# EasyEDA schematic SCH_Keyboard_2024-07-21.json
TITLE: Keyboard; REV: 1.0; Date: 2024-06-02; Sheet: 1/1; Drawn By: cashimor; Company: Mosha
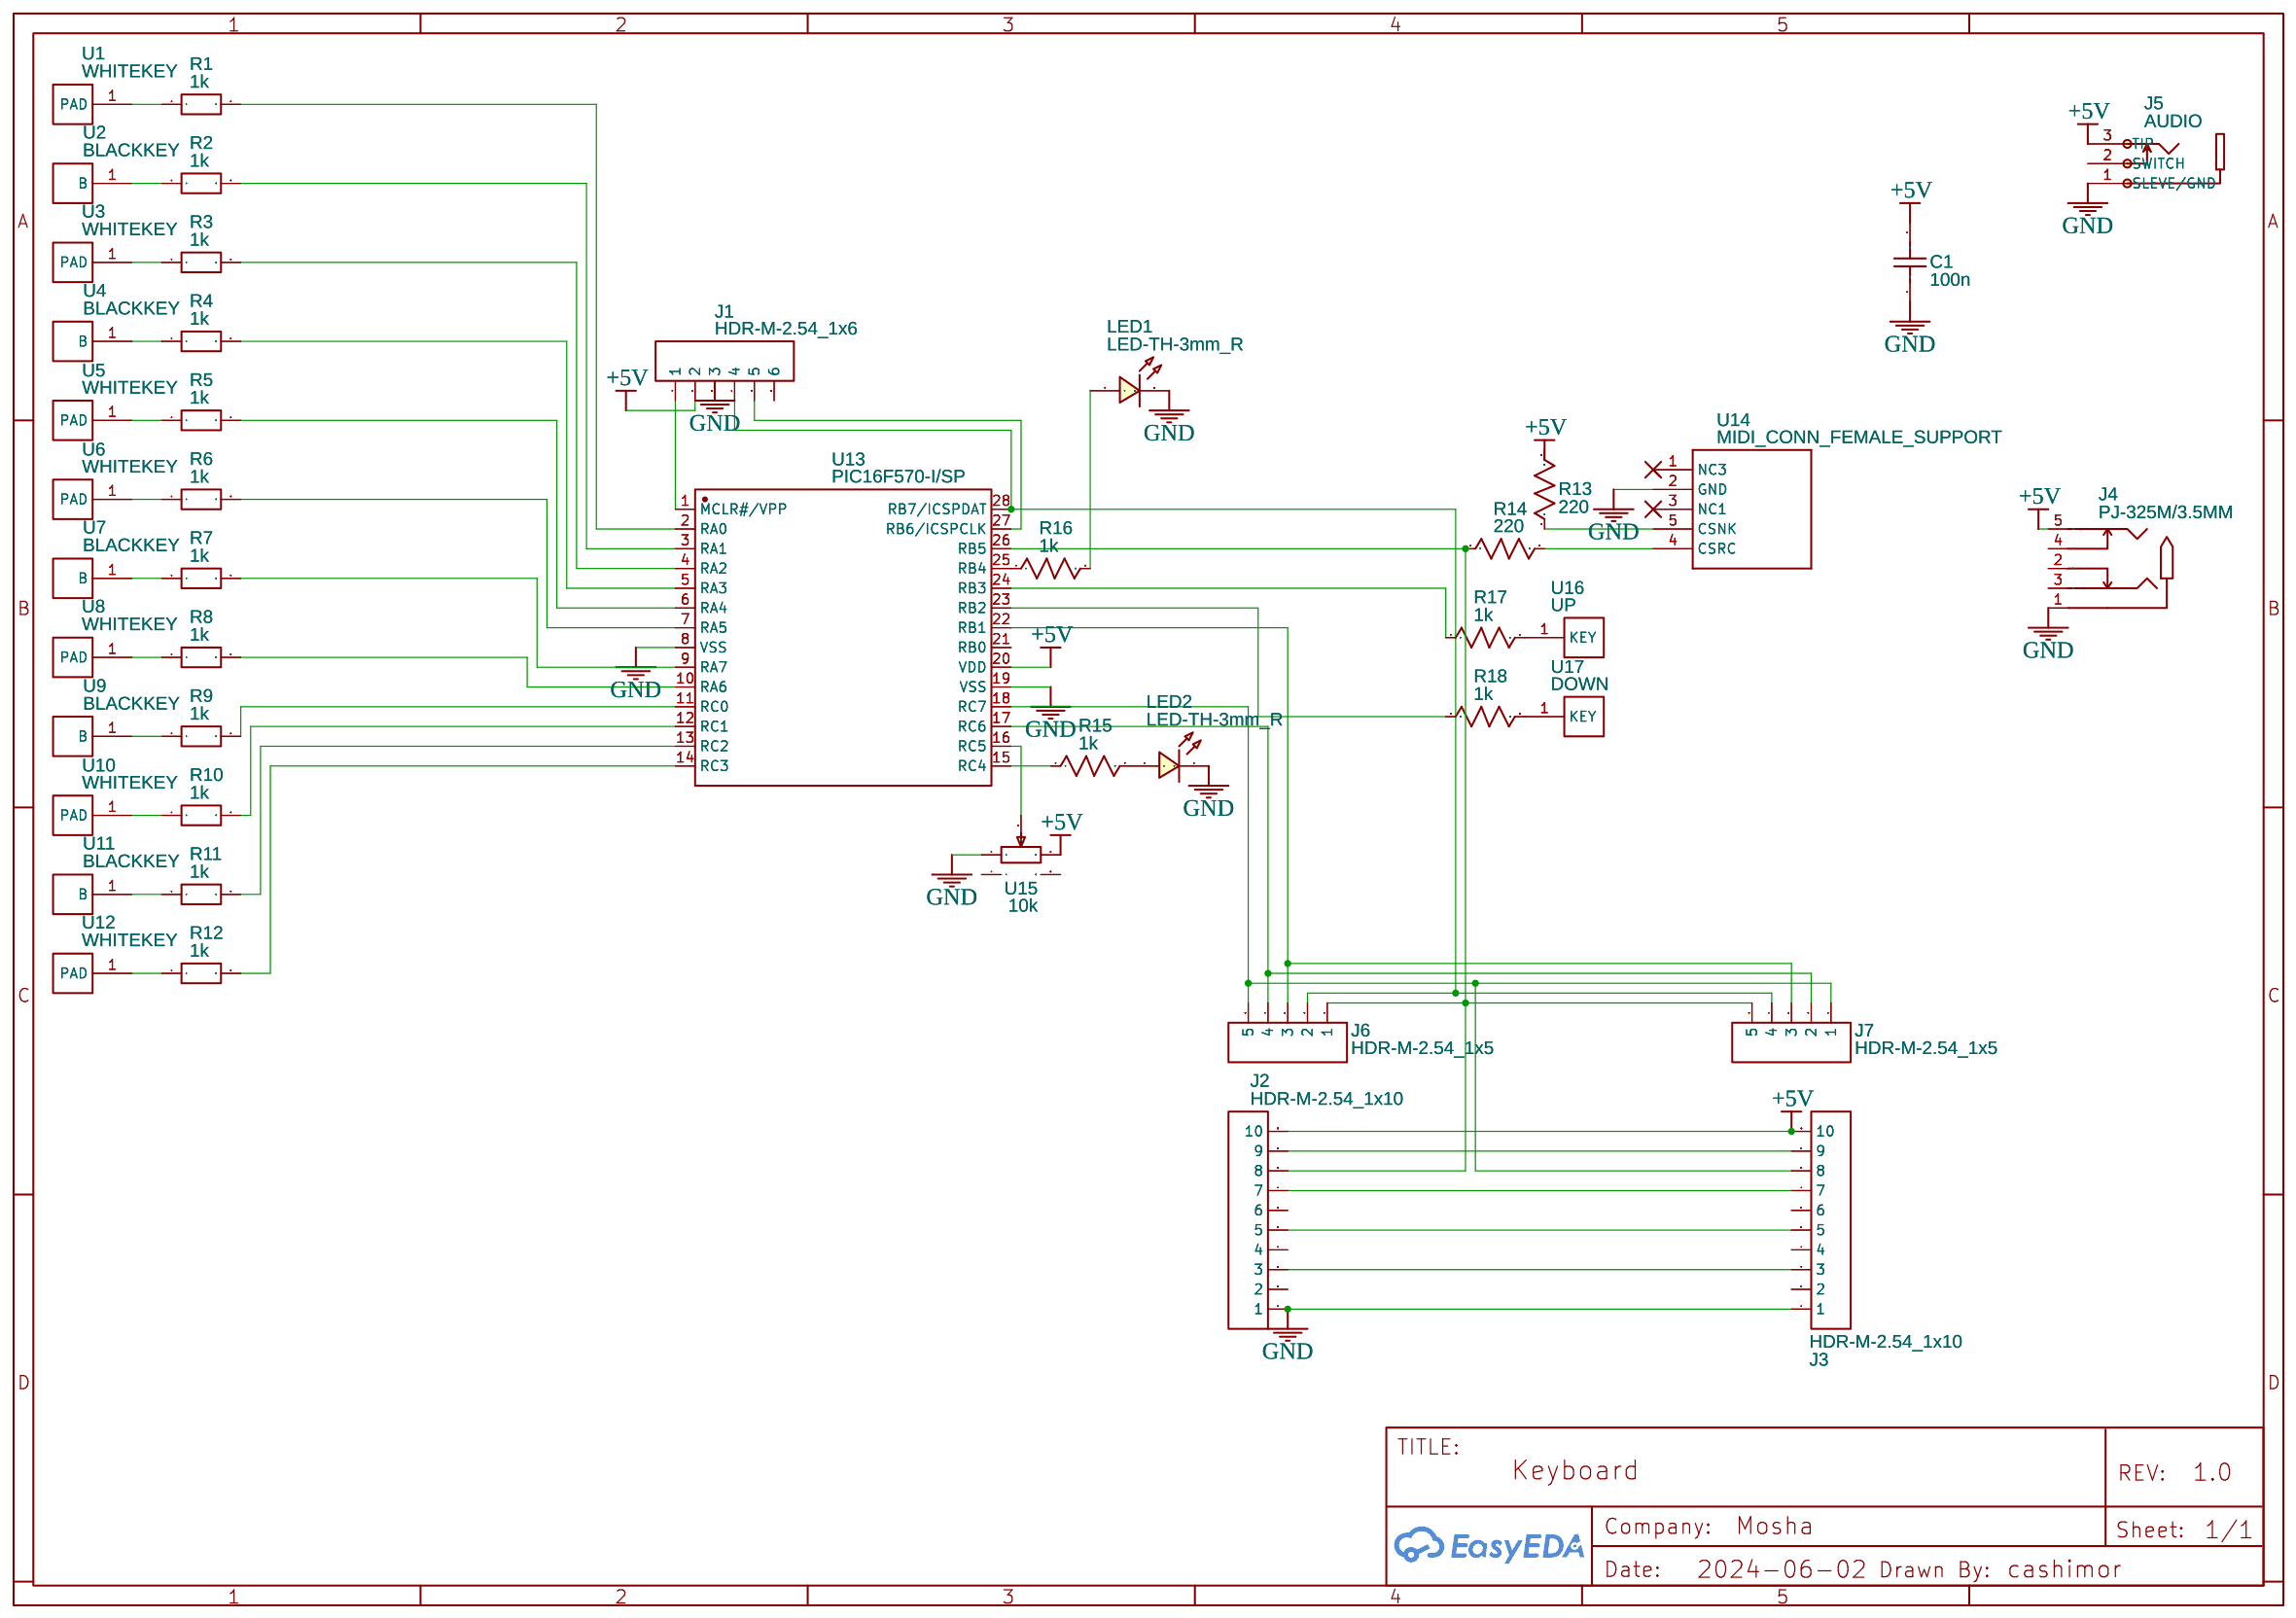
[diagram p0: schematic sheet]

## Parts
C1  100n  [RAD-0.1]
J1  HDR-M-2.54_1x6  [HDR-M-2.54_1X6]
J2  HDR-M-2.54_1x10  [HDR-M-2.54_1X10]
J3  HDR-M-2.54_1x10  [HDR-M-2.54_1X10]
J4  PJ-325M/3.5MM  [AUDIO-TH_PJ-325C]
J5  AUDIO  [THONKICONN_1]
J6  HDR-M-2.54_1x5  [HDR-M-2.54_1X5]
J7  HDR-M-2.54_1x5  [HDR-M-2.54_1X5]
LED1  LED-TH-3mm_R  [LED-TH_BD3.0_RED]
LED2  LED-TH-3mm_R  [LED-TH_BD3.0_RED]
R1  1k  [R_AXIAL-0.3]
R2  1k  [R_AXIAL-0.3]
R3  1k  [R_AXIAL-0.3]
R4  1k  [R_AXIAL-0.3]
R5  1k  [R_AXIAL-0.3]
R6  1k  [R_AXIAL-0.3]
R7  1k  [R_AXIAL-0.3]
R8  1k  [R_AXIAL-0.3]
R9  1k  [R_AXIAL-0.3]
R10  1k  [R_AXIAL-0.3]
R11  1k  [R_AXIAL-0.3]
R12  1k  [R_AXIAL-0.3]
R13  220  [R_AXIAL-0.3]
R14  220  [R_AXIAL-0.3]
R15  1k  [R_AXIAL-0.3]
R16  1k  [R_AXIAL-0.3]
R17  1k  [R_AXIAL-0.3]
R18  1k  [R_AXIAL-0.3]
U1  WHITEKEY  [WHITEKEY]
U2  BLACKKEY  [BLACKKEY]
U3  WHITEKEY  [WHITEKEY]
U4  BLACKKEY  [BLACKKEY]
U5  WHITEKEY  [WHITEKEY]
U6  WHITEKEY  [WHITEKEY]
U7  BLACKKEY  [BLACKKEY]
U8  WHITEKEY  [WHITEKEY]
U9  BLACKKEY  [BLACKKEY]
U10  WHITEKEY  [WHITEKEY]
U11  BLACKKEY  [BLACKKEY]
U12  WHITEKEY  [WHITEKEY]
U13  PIC16F570-I/SP  [SPDIP-28_L34.7-W7.2-P2.54-LS7.9-BL]
U14  MIDI_CONN_FEMALE_SUPPORT  [DIN_5_FEMALE_SUPPORT]
U15  10k  [RES-ADJ-TH_POT-R09V-100K]
U16  UP  [PIANOTOUCH]
U17  DOWN  [PIANOTOUCH]

## Library data of the parts
C1 = C_RAD-0.1_US: Contributor: LCEDA_Lib
J1 = HDR-M-2.54_1x6: Supplier Part: C190819; Supplier: LCSC; Contributor: LCEDA_Lib
J2 J3 = HDR-M-2.54_1x10: Supplier Part: C57369; Supplier: LCSC; Contributor: LCEDA_Lib
J4 = PJ-325M/3.5MM: Supplier: LCSC; Manufacturer: BOOMELE(博穆精密); Manufacturer Part: PJ325外铜套; Supplier Part: C26230; JLCPCB Part Class: Extended Part
J5 = THONKICONN_1: Manufacturer Part: Thonk; Contributor: ashimoke
J6 J7 = HDR-M-2.54_1x5: Supplier Part: C358687; Supplier: LCSC; Contributor: LCEDA_Lib
LED1 LED2 = LED-TH-3mm_R: Manufacturer: EVERLIGHT(台湾亿光); Manufacturer Part: 204-10SDRD/S530-A3-L; Supplier Part: C84774; Supplier: LCSC; Contributor: LCEDA_Lib
R1-R12 = R_AXIAL-0.3_EU: Contributor: LCEDA_Lib
R13-R18 = R_AXIAL-0.3_US: Contributor: LCEDA_Lib
U1 U3 U5 U6 U8 U10 U12 = WHITEKEY: Contributor: cashimor
U2 U4 U7 U9 U11 = BLACKKEY: Contributor: cashimor
U13 = PIC16F570-I/SP: Contributor: LCSC; Supplier: LCSC; Supplier Part: C647539; Manufacturer: MICROCHIP(美国微芯); JLCPCB Part Class: Extended Part
U14 = MIDI_CONN_FEMALE_SUPPORT: MIDI connector with strain relief (DIN-5 female); Contributor: SparkFun
U15 = POT-R09V-100K: Contributor: lcsc; Supplier: LCSC; Supplier Part: C9900018037; Manufacturer: null; JLCPCB Part Class: Extended Part; link: https://lcsc.com/eda_search?q=C9900018037&%26type=1&ref=editor
U16 U17 = PIANOTOUCHKEY: Contributor: cashimor

## Nets
+5V: C1.2 J1.2 J2.10 J3.10 J4.5 J5.3(TIP) R13.2 U13.20(VDD) U15.3
GND: C1.1 J1.3 J2.1 J3.1 J4.1 J5.1(SLEVE/GND) LED1.2 LED2.2 U13.8(VSS) U13.19(VSS) U14.2(GND) U15.1
Net-(J1-1): J1.1 U13.1(MCLR#/VPP)
Net-(J1-4): J1.4 J6.2 J7.4 U13.28(RB7/ICSPDAT)
Net-(J1-5): J1.5 U13.27(RB6/ICSPCLK)
Net-(J2-3): J2.3 J3.3
Net-(J2-5): J2.5 J3.5
Net-(J2-7): J2.7 J3.7
Net-(J2-8): J2.8 J6.1 J7.5 R14.1 U13.26(RB5)
Net-(J2-9): J2.9 J3.9
Net-(J3-8): J3.8 J6.5 J7.1 U13.18(RC7)
Net-(J6-3): J6.3 J7.3 U13.22(RB1)
Net-(J6-4): J6.4 J7.2 U13.17(RC6)
Net-(LED1-1): LED1.1 R16.2
Net-(LED2-1): LED2.1 R15.2
Net-(R1-1): R1.1 U1.1(PAD)
Net-(R1-2): R1.2 U13.2(RA0)
Net-(R2-1): R2.1 U2.1(B)
Net-(R2-2): R2.2 U13.3(RA1)
Net-(R3-1): R3.1 U3.1(PAD)
Net-(R3-2): R3.2 U13.4(RA2)
Net-(R4-1): R4.1 U4.1(B)
Net-(R4-2): R4.2 U13.5(RA3)
Net-(R5-1): R5.1 U5.1(PAD)
Net-(R5-2): R5.2 U13.6(RA4)
Net-(R6-1): R6.1 U6.1(PAD)
Net-(R6-2): R6.2 U13.7(RA5)
Net-(R7-1): R7.1 U7.1(B)
Net-(R7-2): R7.2 U13.9(RA7)
Net-(R8-1): R8.1 U8.1(PAD)
Net-(R8-2): R8.2 U13.10(RA6)
Net-(R9-1): R9.1 U9.1(B)
Net-(R9-2): R9.2 U13.11(RC0)
Net-(R10-1): R10.1 U10.1(PAD)
Net-(R10-2): R10.2 U13.12(RC1)
Net-(R11-1): R11.1 U11.1(B)
Net-(R11-2): R11.2 U13.13(RC2)
Net-(R12-1): R12.1 U12.1(PAD)
Net-(R12-2): R12.2 U13.14(RC3)
Net-(R13-1): R13.1 U14.5(CSNK)
Net-(R14-2): R14.2 U14.4(CSRC)
Net-(R15-1): R15.1 U13.15(RC4)
Net-(R16-1): R16.1 U13.25(RB4)
Net-(R17-1): R17.1 U13.24(RB3)
Net-(R17-2): R17.2 U16.1(KEY)
Net-(R18-1): R18.1 U13.23(RB2)
Net-(R18-2): R18.2 U17.1(KEY)
Net-(U13-16): U13.16(RC5) U15.2

Not connected (* = marked no-connect by the designer): J1 6; J2 2 4 6; J3 2 4 6; J4 2 3 4; J5 2(SWITCH); U13 21(RB0); U14 1(NC3) 3(NC1); U15 4 5
